# Altium project KeyboardMoudle.PrjPCB
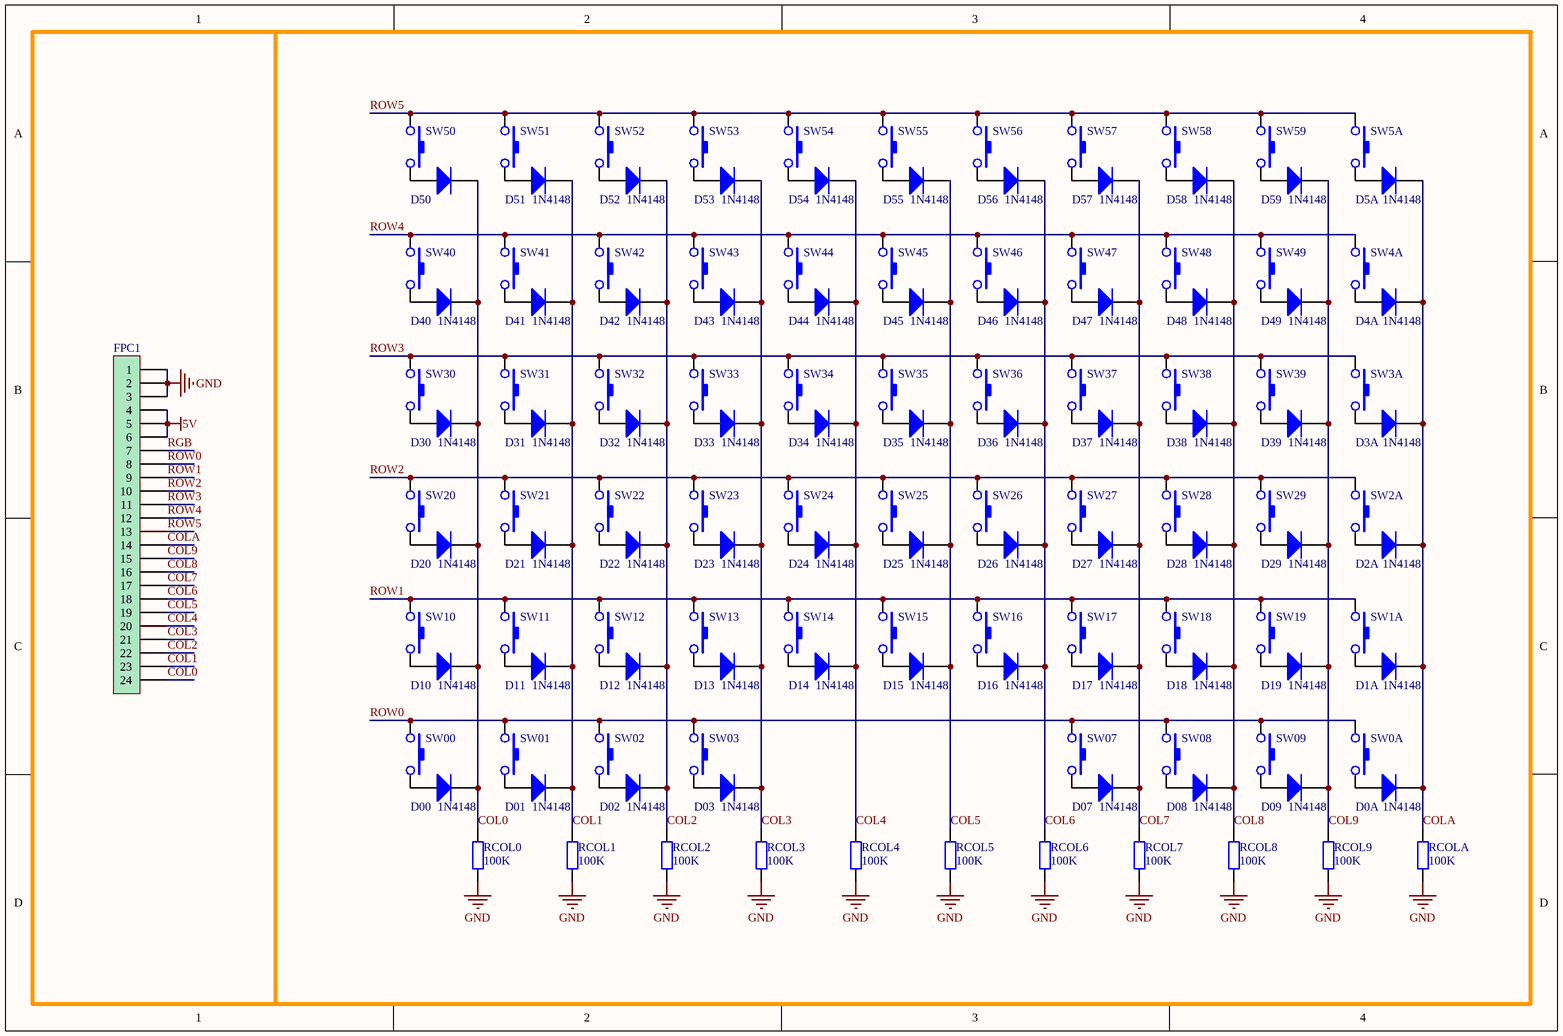
[diagram p0: KeyboardMoudle1.SchDoc]
2 sheets, 264 parts. Net scope: global (net labels, ports and power ports of the same name join across sheets).
Board file: KeyboardMoudle.PcbDoc
Sheets:
  KeyboardMoudle1.SchDoc
  KeyboardMoudle2.SchDoc

## Sheet KeyboardMoudle1.SchDoc
size A4

### Parts
D00  1N4148  [SOD523]
D0A  1N4148  [SOD523]
D01  1N4148  [SOD523]
D1A  1N4148  [SOD523]
D02  1N4148  [SOD523]
D2A  1N4148  [SOD523]
D03  1N4148  [SOD523]
D3A  1N4148  [SOD523]
D4A  1N4148  [SOD523]
D5A  1N4148  [SOD523]
D07  1N4148  [SOD523]
D08  1N4148  [SOD523]
D09  1N4148  [SOD523]
D10  1N4148  [SOD523]
D11  1N4148  [SOD523]
D12  1N4148  [SOD523]
D13  1N4148  [SOD523]
D14  1N4148  [SOD523]
D15  1N4148  [SOD523]
D16  1N4148  [SOD523]
D17  1N4148  [SOD523]
D18  1N4148  [SOD523]
D19  1N4148  [SOD523]
D20  1N4148  [SOD523]
D21  1N4148  [SOD523]
D22  1N4148  [SOD523]
D23  1N4148  [SOD523]
D24  1N4148  [SOD523]
D25  1N4148  [SOD523]
D26  1N4148  [SOD523]
D27  1N4148  [SOD523]
D28  1N4148  [SOD523]
D29  1N4148  [SOD523]
D30  1N4148  [SOD523]
D31  1N4148  [SOD523]
D32  1N4148  [SOD523]
D33  1N4148  [SOD523]
D34  1N4148  [SOD523]
D35  1N4148  [SOD523]
D36  1N4148  [SOD523]
D37  1N4148  [SOD523]
D38  1N4148  [SOD523]
D39  1N4148  [SOD523]
D40  1N4148  [SOD523]
D41  1N4148  [SOD523]
D42  1N4148  [SOD523]
D43  1N4148  [SOD523]
D44  1N4148  [SOD523]
D45  1N4148  [SOD523]
D46  1N4148  [SOD523]
D47  1N4148  [SOD523]
D48  1N4148  [SOD523]
D49  1N4148  [SOD523]
D50  (no value)  [SOD523]
D51  1N4148  [SOD523]
D52  1N4148  [SOD523]
D53  1N4148  [SOD523]
D54  1N4148  [SOD523]
D55  1N4148  [SOD523]
D56  1N4148  [SOD523]
D57  1N4148  [SOD523]
D58  1N4148  [SOD523]
D59  1N4148  [SOD523]
FPC1  FPC_0.5_24P  [FPC_0.5_24PIN]  (value not drawn)
RCOL0  100K  [R_0603]
RCOL1  100K  [R_0603]
RCOL2  100K  [R_0603]
RCOL3  100K  [R_0603]
RCOL4  100K  [R_0603]
RCOL5  100K  [R_0603]
RCOL6  100K  [R_0603]
RCOL7  100K  [R_0603]
RCOL8  100K  [R_0603]
RCOL9  100K  [R_0603]
RCOLA  100K  [R_0603]
SW00  KAILH  [KAILH_1350_HOTSWAP]  (value not drawn)
SW0A  KAILH  [KAILH_1350_HOTSWAP]  (value not drawn)
SW01  KAILH  [KAILH_1350_HOTSWAP]  (value not drawn)
SW1A  KAILH  [KAILH_1350_HOTSWAP]  (value not drawn)
SW02  KAILH  [KAILH_1350_HOTSWAP]  (value not drawn)
SW2A  KAILH  [KAILH_1350_HOTSWAP]  (value not drawn)
SW03  KAILH  [KAILH_1350_HOTSWAP]  (value not drawn)
SW3A  KAILH  [KAILH_1350_HOTSWAP]  (value not drawn)
SW4A  KAILH  [KAILH_1350_HOTSWAP]  (value not drawn)
SW5A  KAILH  [KAILH_1350_HOTSWAP]  (value not drawn)
SW07  KAILH  [KAILH_1350_HOTSWAP]  (value not drawn)
SW08  KAILH  [KAILH_1350_HOTSWAP]  (value not drawn)
SW09  KAILH  [KAILH_1350_HOTSWAP]  (value not drawn)
SW10  KAILH  [KAILH_1350_HOTSWAP]  (value not drawn)
SW11  KAILH  [KAILH_1350_HOTSWAP]  (value not drawn)
SW12  KAILH  [KAILH_1350_HOTSWAP]  (value not drawn)
SW13  KAILH  [KAILH_1350_HOTSWAP]  (value not drawn)
SW14  KAILH  [KAILH_1350_HOTSWAP]  (value not drawn)
SW15  KAILH  [KAILH_1350_HOTSWAP]  (value not drawn)
SW16  KAILH  [KAILH_1350_HOTSWAP]  (value not drawn)
SW17  KAILH  [KAILH_1350_HOTSWAP]  (value not drawn)
SW18  KAILH  [KAILH_1350_HOTSWAP]  (value not drawn)
SW19  KAILH  [KAILH_1350_HOTSWAP]  (value not drawn)
SW20  KAILH  [KAILH_1350_HOTSWAP]  (value not drawn)
SW21  KAILH  [KAILH_1350_HOTSWAP]  (value not drawn)
SW22  KAILH  [KAILH_1350_HOTSWAP]  (value not drawn)
SW23  KAILH  [KAILH_1350_HOTSWAP]  (value not drawn)
SW24  KAILH  [KAILH_1350_HOTSWAP]  (value not drawn)
SW25  KAILH  [KAILH_1350_HOTSWAP]  (value not drawn)
SW26  KAILH  [KAILH_1350_HOTSWAP]  (value not drawn)
SW27  KAILH  [KAILH_1350_HOTSWAP]  (value not drawn)
SW28  KAILH  [KAILH_1350_HOTSWAP]  (value not drawn)
SW29  KAILH  [KAILH_1350_HOTSWAP]  (value not drawn)
SW30  KAILH  [KAILH_1350_HOTSWAP]  (value not drawn)
SW31  KAILH  [KAILH_1350_HOTSWAP]  (value not drawn)
SW32  KAILH  [KAILH_1350_HOTSWAP]  (value not drawn)
SW33  KAILH  [KAILH_1350_HOTSWAP]  (value not drawn)
SW34  KAILH  [KAILH_1350_HOTSWAP]  (value not drawn)
SW35  KAILH  [KAILH_1350_HOTSWAP]  (value not drawn)
SW36  KAILH  [KAILH_1350_HOTSWAP]  (value not drawn)
SW37  KAILH  [KAILH_1350_HOTSWAP]  (value not drawn)
SW38  KAILH  [KAILH_1350_HOTSWAP]  (value not drawn)
SW39  KAILH  [KAILH_1350_HOTSWAP]  (value not drawn)
SW40  KAILH  [KAILH_1350_HOTSWAP]  (value not drawn)
SW41  KAILH  [KAILH_1350_HOTSWAP]  (value not drawn)
SW42  KAILH  [KAILH_1350_HOTSWAP]  (value not drawn)
SW43  KAILH  [KAILH_1350_HOTSWAP]  (value not drawn)
SW44  KAILH  [KAILH_1350_HOTSWAP]  (value not drawn)
SW45  KAILH  [KAILH_1350_HOTSWAP]  (value not drawn)
SW46  KAILH  [KAILH_1350_HOTSWAP]  (value not drawn)
SW47  KAILH  [KAILH_1350_HOTSWAP]  (value not drawn)
SW48  KAILH  [KAILH_1350_HOTSWAP]  (value not drawn)
SW49  KAILH  [KAILH_1350_HOTSWAP]  (value not drawn)
SW50  KAILH  [KAILH_1350_HOTSWAP]  (value not drawn)
SW51  KAILH  [KAILH_1350_HOTSWAP]  (value not drawn)
SW52  KAILH  [KAILH_1350_HOTSWAP]  (value not drawn)
SW53  KAILH  [KAILH_1350_HOTSWAP]  (value not drawn)
SW54  KAILH  [KAILH_1350_HOTSWAP]  (value not drawn)
SW55  KAILH  [KAILH_1350_HOTSWAP]  (value not drawn)
SW56  KAILH  [KAILH_1350_HOTSWAP]  (value not drawn)
SW57  KAILH  [KAILH_1350_HOTSWAP]  (value not drawn)
SW58  KAILH  [KAILH_1350_HOTSWAP]  (value not drawn)
SW59  KAILH  [KAILH_1350_HOTSWAP]  (value not drawn)

### Nets
5V: FPC1.4 FPC1.5 FPC1.6
GND: FPC1.1 FPC1.2 FPC1.3 RCOL0.1 RCOL1.1 RCOL2.1 RCOL3.1 RCOL4.1 RCOL5.1 RCOL6.1 RCOL7.1 RCOL8.1 RCOL9.1 RCOLA.1
COL0: D00.2(K) D10.2(K) D20.2(K) D30.2(K) D40.2(K) D50.2(K) FPC1.24 RCOL0.2
COL1: D01.2(K) D11.2(K) D21.2(K) D31.2(K) D41.2(K) D51.2(K) FPC1.23 RCOL1.2
COL2: D02.2(K) D12.2(K) D22.2(K) D32.2(K) D42.2(K) D52.2(K) FPC1.22 RCOL2.2
COL3: D03.2(K) D13.2(K) D23.2(K) D33.2(K) D43.2(K) D53.2(K) FPC1.21 RCOL3.2
COL4: D14.2(K) D24.2(K) D34.2(K) D44.2(K) D54.2(K) FPC1.20 RCOL4.2
COL5: D15.2(K) D25.2(K) D35.2(K) D45.2(K) D55.2(K) FPC1.19 RCOL5.2
COL6: D16.2(K) D26.2(K) D36.2(K) D46.2(K) D56.2(K) FPC1.18 RCOL6.2
COL7: D07.2(K) D17.2(K) D27.2(K) D37.2(K) D47.2(K) D57.2(K) FPC1.17 RCOL7.2
COL8: D08.2(K) D18.2(K) D28.2(K) D38.2(K) D48.2(K) D58.2(K) FPC1.16 RCOL8.2
COL9: D09.2(K) D19.2(K) D29.2(K) D39.2(K) D49.2(K) D59.2(K) FPC1.15 RCOL9.2
COLA: D0A.2(K) D1A.2(K) D2A.2(K) D3A.2(K) D4A.2(K) D5A.2(K) FPC1.14 RCOLA.2
RGB: FPC1.7
ROW0: FPC1.8 SW00.1 SW0A.1 SW01.1 SW02.1 SW03.1 SW07.1 SW08.1 SW09.1
ROW1: FPC1.9 SW1A.1 SW10.1 SW11.1 SW12.1 SW13.1 SW14.1 SW15.1 SW16.1 SW17.1 SW18.1 SW19.1
ROW2: FPC1.10 SW2A.1 SW20.1 SW21.1 SW22.1 SW23.1 SW24.1 SW25.1 SW26.1 SW27.1 SW28.1 SW29.1
ROW3: FPC1.11 SW3A.1 SW30.1 SW31.1 SW32.1 SW33.1 SW34.1 SW35.1 SW36.1 SW37.1 SW38.1 SW39.1
ROW4: FPC1.12 SW4A.1 SW40.1 SW41.1 SW42.1 SW43.1 SW44.1 SW45.1 SW46.1 SW47.1 SW48.1 SW49.1
ROW5: FPC1.13 SW5A.1 SW50.1 SW51.1 SW52.1 SW53.1 SW54.1 SW55.1 SW56.1 SW57.1 SW58.1 SW59.1
NetD00_1: D00.1(A) SW00.2
NetD0A_1: D0A.1(A) SW0A.2
NetD01_1: D01.1(A) SW01.2
NetD1A_1: D1A.1(A) SW1A.2
NetD02_1: D02.1(A) SW02.2
NetD2A_1: D2A.1(A) SW2A.2
NetD03_1: D03.1(A) SW03.2
NetD3A_1: D3A.1(A) SW3A.2
NetD4A_1: D4A.1(A) SW4A.2
NetD5A_1: D5A.1(A) SW5A.2
NetD07_1: D07.1(A) SW07.2
NetD08_1: D08.1(A) SW08.2
NetD09_1: D09.1(A) SW09.2
NetD10_1: D10.1(A) SW10.2
NetD11_1: D11.1(A) SW11.2
NetD12_1: D12.1(A) SW12.2
NetD13_1: D13.1(A) SW13.2
NetD14_1: D14.1(A) SW14.2
NetD15_1: D15.1(A) SW15.2
NetD16_1: D16.1(A) SW16.2
NetD17_1: D17.1(A) SW17.2
NetD18_1: D18.1(A) SW18.2
NetD19_1: D19.1(A) SW19.2
NetD20_1: D20.1(A) SW20.2
NetD21_1: D21.1(A) SW21.2
NetD22_1: D22.1(A) SW22.2
NetD23_1: D23.1(A) SW23.2
NetD24_1: D24.1(A) SW24.2
NetD25_1: D25.1(A) SW25.2
NetD26_1: D26.1(A) SW26.2
NetD27_1: D27.1(A) SW27.2
NetD28_1: D28.1(A) SW28.2
NetD29_1: D29.1(A) SW29.2
NetD30_1: D30.1(A) SW30.2
NetD31_1: D31.1(A) SW31.2
NetD32_1: D32.1(A) SW32.2
NetD33_1: D33.1(A) SW33.2
NetD34_1: D34.1(A) SW34.2
NetD35_1: D35.1(A) SW35.2
NetD36_1: D36.1(A) SW36.2
NetD37_1: D37.1(A) SW37.2
NetD38_1: D38.1(A) SW38.2
NetD39_1: D39.1(A) SW39.2
NetD40_1: D40.1(A) SW40.2
NetD41_1: D41.1(A) SW41.2
NetD42_1: D42.1(A) SW42.2
NetD43_1: D43.1(A) SW43.2
NetD44_1: D44.1(A) SW44.2
NetD45_1: D45.1(A) SW45.2
NetD46_1: D46.1(A) SW46.2
NetD47_1: D47.1(A) SW47.2
NetD48_1: D48.1(A) SW48.2
NetD49_1: D49.1(A) SW49.2
NetD50_1: D50.1(A) SW50.2
NetD51_1: D51.1(A) SW51.2
NetD52_1: D52.1(A) SW52.2
NetD53_1: D53.1(A) SW53.2
NetD54_1: D54.1(A) SW54.2
NetD55_1: D55.1(A) SW55.2
NetD56_1: D56.1(A) SW56.2
NetD57_1: D57.1(A) SW57.2
NetD58_1: D58.1(A) SW58.2
NetD59_1: D59.1(A) SW59.2

### Library data of the parts
D00 D0A D01 D1A D02 D2A D03 D3A D4A D5A D07 D08 D09-D59 = DIO_1N4148_SOD523: 开关二极管
FPC1 = FPC_0.5_24P: FPC 0.5 24Pin
RCOL0-RCOL9 RCOLA = RES_0603: 电阻 0603
SW00 SW0A SW01 SW1A SW02 SW2A SW03 SW3A SW4A SW5A SW07 SW08 SW09-SW59 = SWITCH_KAILH_1350: 凯华机械矮轴1350用热插拔轴座

## Sheet KeyboardMoudle2.SchDoc
size A4
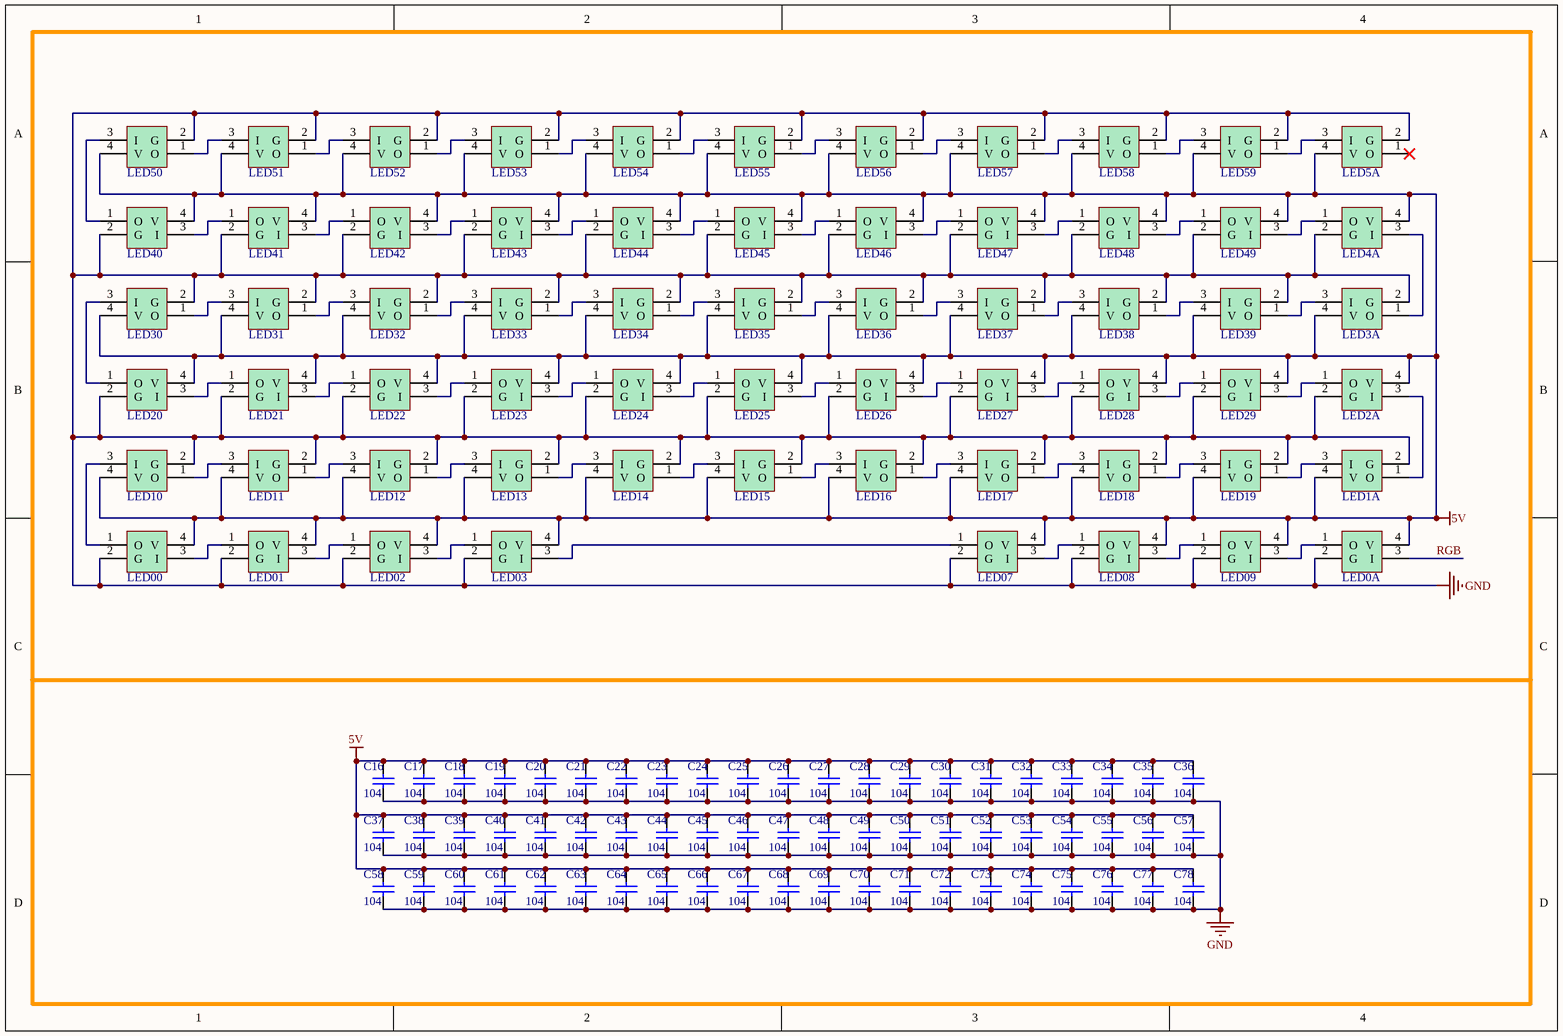
[diagram p1: KeyboardMoudle2.SchDoc]

### Parts
C16  104  [0603]
C17  104  [0603]
C18  104  [0603]
C19  104  [0603]
C20  104  [0603]
C21  104  [0603]
C22  104  [0603]
C23  104  [0603]
C24  104  [0603]
C25  104  [0603]
C26  104  [0603]
C27  104  [0603]
C28  104  [0603]
C29  104  [0603]
C30  104  [0603]
C31  104  [0603]
C32  104  [0603]
C33  104  [0603]
C34  104  [0603]
C35  104  [0603]
C36  104  [0603]
C37  104  [0603]
C38  104  [0603]
C39  104  [0603]
C40  104  [0603]
C41  104  [0603]
C42  104  [0603]
C43  104  [0603]
C44  104  [0603]
C45  104  [0603]
C46  104  [0603]
C47  104  [0603]
C48  104  [0603]
C49  104  [0603]
C50  104  [0603]
C51  104  [0603]
C52  104  [0603]
C53  104  [0603]
C54  104  [0603]
C55  104  [0603]
C56  104  [0603]
C57  104  [0603]
C58  104  [0603]
C59  104  [0603]
C60  104  [0603]
C61  104  [0603]
C62  104  [0603]
C63  104  [0603]
C64  104  [0603]
C65  104  [0603]
C66  104  [0603]
C67  104  [0603]
C68  104  [0603]
C69  104  [0603]
C70  104  [0603]
C71  104  [0603]
C72  104  [0603]
C73  104  [0603]
C74  104  [0603]
C75  104  [0603]
C76  104  [0603]
C77  104  [0603]
C78  104  [0603]
LED00  WS2812  [LED_WS2812_2020]  (value not drawn)
LED0A  WS2812  [LED_WS2812_2020]  (value not drawn)
LED01  WS2812  [LED_WS2812_2020]  (value not drawn)
LED1A  WS2812  [LED_WS2812_2020]  (value not drawn)
LED02  WS2812  [LED_WS2812_2020]  (value not drawn)
LED2A  WS2812  [LED_WS2812_2020]  (value not drawn)
LED03  WS2812  [LED_WS2812_2020]  (value not drawn)
LED3A  WS2812  [LED_WS2812_2020]  (value not drawn)
LED4A  WS2812  [LED_WS2812_2020]  (value not drawn)
LED5A  WS2812  [LED_WS2812_2020]  (value not drawn)
LED07  WS2812  [LED_WS2812_2020]  (value not drawn)
LED08  WS2812  [LED_WS2812_2020]  (value not drawn)
LED09  WS2812  [LED_WS2812_2020]  (value not drawn)
LED10  WS2812  [LED_WS2812_2020]  (value not drawn)
LED11  WS2812  [LED_WS2812_2020]  (value not drawn)
LED12  WS2812  [LED_WS2812_2020]  (value not drawn)
LED13  WS2812  [LED_WS2812_2020]  (value not drawn)
LED14  WS2812  [LED_WS2812_2020]  (value not drawn)
LED15  WS2812  [LED_WS2812_2020]  (value not drawn)
LED16  WS2812  [LED_WS2812_2020]  (value not drawn)
LED17  WS2812  [LED_WS2812_2020]  (value not drawn)
LED18  WS2812  [LED_WS2812_2020]  (value not drawn)
LED19  WS2812  [LED_WS2812_2020]  (value not drawn)
LED20  WS2812  [LED_WS2812_2020]  (value not drawn)
LED21  WS2812  [LED_WS2812_2020]  (value not drawn)
LED22  WS2812  [LED_WS2812_2020]  (value not drawn)
LED23  WS2812  [LED_WS2812_2020]  (value not drawn)
LED24  WS2812  [LED_WS2812_2020]  (value not drawn)
LED25  WS2812  [LED_WS2812_2020]  (value not drawn)
LED26  WS2812  [LED_WS2812_2020]  (value not drawn)
LED27  WS2812  [LED_WS2812_2020]  (value not drawn)
LED28  WS2812  [LED_WS2812_2020]  (value not drawn)
LED29  WS2812  [LED_WS2812_2020]  (value not drawn)
LED30  WS2812  [LED_WS2812_2020]  (value not drawn)
LED31  WS2812  [LED_WS2812_2020]  (value not drawn)
LED32  WS2812  [LED_WS2812_2020]  (value not drawn)
LED33  WS2812  [LED_WS2812_2020]  (value not drawn)
LED34  WS2812  [LED_WS2812_2020]  (value not drawn)
LED35  WS2812  [LED_WS2812_2020]  (value not drawn)
LED36  WS2812  [LED_WS2812_2020]  (value not drawn)
LED37  WS2812  [LED_WS2812_2020]  (value not drawn)
LED38  WS2812  [LED_WS2812_2020]  (value not drawn)
LED39  WS2812  [LED_WS2812_2020]  (value not drawn)
LED40  WS2812  [LED_WS2812_2020]  (value not drawn)
LED41  WS2812  [LED_WS2812_2020]  (value not drawn)
LED42  WS2812  [LED_WS2812_2020]  (value not drawn)
LED43  WS2812  [LED_WS2812_2020]  (value not drawn)
LED44  WS2812  [LED_WS2812_2020]  (value not drawn)
LED45  WS2812  [LED_WS2812_2020]  (value not drawn)
LED46  WS2812  [LED_WS2812_2020]  (value not drawn)
LED47  WS2812  [LED_WS2812_2020]  (value not drawn)
LED48  WS2812  [LED_WS2812_2020]  (value not drawn)
LED49  WS2812  [LED_WS2812_2020]  (value not drawn)
LED50  WS2812  [LED_WS2812_2020]  (value not drawn)
LED51  WS2812  [LED_WS2812_2020]  (value not drawn)
LED52  WS2812  [LED_WS2812_2020]  (value not drawn)
LED53  WS2812  [LED_WS2812_2020]  (value not drawn)
LED54  WS2812  [LED_WS2812_2020]  (value not drawn)
LED55  WS2812  [LED_WS2812_2020]  (value not drawn)
LED56  WS2812  [LED_WS2812_2020]  (value not drawn)
LED57  WS2812  [LED_WS2812_2020]  (value not drawn)
LED58  WS2812  [LED_WS2812_2020]  (value not drawn)
LED59  WS2812  [LED_WS2812_2020]  (value not drawn)

### Nets
5V: C16.2 C17.2 C18.2 C19.2 C20.2 C21.2 C22.2 C23.2 C24.2 C25.2 C26.2 C27.2 C28.2 C29.2 C30.2 C31.2 C32.2 C33.2 C34.2 C35.2 C36.2 C37.2 C38.2 C39.2 C40.2 C41.2 C42.2 C43.2 C44.2 C45.2 C46.2 C47.2 C48.2 C49.2 C50.2 C51.2 C52.2 C53.2 C54.2 C55.2 C56.2 C57.2 C58.2 C59.2 C60.2 C61.2 C62.2 C63.2 C64.2 C65.2 C66.2 C67.2 C68.2 C69.2 C70.2 C71.2 C72.2 C73.2 C74.2 C75.2 C76.2 C77.2 C78.2 LED00.4(V) LED0A.4(V) LED01.4(V) LED1A.4(V) LED02.4(V) LED2A.4(V) LED03.4(V) LED3A.4(V) LED4A.4(V) LED5A.4(V) LED07.4(V) LED08.4(V) LED09.4(V) LED10.4(V) LED11.4(V) LED12.4(V) LED13.4(V) LED14.4(V) LED15.4(V) LED16.4(V) LED17.4(V) LED18.4(V) LED19.4(V) LED20.4(V) LED21.4(V) LED22.4(V) LED23.4(V) LED24.4(V) LED25.4(V) LED26.4(V) LED27.4(V) LED28.4(V) LED29.4(V) LED30.4(V) LED31.4(V) LED32.4(V) LED33.4(V) LED34.4(V) LED35.4(V) LED36.4(V) LED37.4(V) LED38.4(V) LED39.4(V) LED40.4(V) LED41.4(V) LED42.4(V) LED43.4(V) LED44.4(V) LED45.4(V) LED46.4(V) LED47.4(V) LED48.4(V) LED49.4(V) LED50.4(V) LED51.4(V) LED52.4(V) LED53.4(V) LED54.4(V) LED55.4(V) LED56.4(V) LED57.4(V) LED58.4(V) LED59.4(V)
GND: C16.1 C17.1 C18.1 C19.1 C20.1 C21.1 C22.1 C23.1 C24.1 C25.1 C26.1 C27.1 C28.1 C29.1 C30.1 C31.1 C32.1 C33.1 C34.1 C35.1 C36.1 C37.1 C38.1 C39.1 C40.1 C41.1 C42.1 C43.1 C44.1 C45.1 C46.1 C47.1 C48.1 C49.1 C50.1 C51.1 C52.1 C53.1 C54.1 C55.1 C56.1 C57.1 C58.1 C59.1 C60.1 C61.1 C62.1 C63.1 C64.1 C65.1 C66.1 C67.1 C68.1 C69.1 C70.1 C71.1 C72.1 C73.1 C74.1 C75.1 C76.1 C77.1 C78.1 LED00.2(G) LED0A.2(G) LED01.2(G) LED1A.2(G) LED02.2(G) LED2A.2(G) LED03.2(G) LED3A.2(G) LED4A.2(G) LED5A.2(G) LED07.2(G) LED08.2(G) LED09.2(G) LED10.2(G) LED11.2(G) LED12.2(G) LED13.2(G) LED14.2(G) LED15.2(G) LED16.2(G) LED17.2(G) LED18.2(G) LED19.2(G) LED20.2(G) LED21.2(G) LED22.2(G) LED23.2(G) LED24.2(G) LED25.2(G) LED26.2(G) LED27.2(G) LED28.2(G) LED29.2(G) LED30.2(G) LED31.2(G) LED32.2(G) LED33.2(G) LED34.2(G) LED35.2(G) LED36.2(G) LED37.2(G) LED38.2(G) LED39.2(G) LED40.2(G) LED41.2(G) LED42.2(G) LED43.2(G) LED44.2(G) LED45.2(G) LED46.2(G) LED47.2(G) LED48.2(G) LED49.2(G) LED50.2(G) LED51.2(G) LED52.2(G) LED53.2(G) LED54.2(G) LED55.2(G) LED56.2(G) LED57.2(G) LED58.2(G) LED59.2(G)
RGB: LED0A.3(I)
NetLED00_1: LED00.1(O) LED10.3(I)
NetLED00_3: LED00.3(I) LED01.1(O)
NetLED0A_1: LED0A.1(O) LED09.3(I)
NetLED01_3: LED01.3(I) LED02.1(O)
NetLED1A_1: LED1A.1(O) LED2A.3(I)
NetLED1A_3: LED1A.3(I) LED19.1(O)
NetLED02_3: LED02.3(I) LED03.1(O)
NetLED2A_1: LED2A.1(O) LED29.3(I)
NetLED03_3: LED03.3(I) LED07.1(O)
NetLED3A_1: LED3A.1(O) LED4A.3(I)
NetLED3A_3: LED3A.3(I) LED39.1(O)
NetLED4A_1: LED4A.1(O) LED49.3(I)
NetLED5A_3: LED5A.3(I) LED59.1(O)
NetLED07_3: LED07.3(I) LED08.1(O)
NetLED08_3: LED08.3(I) LED09.1(O)
NetLED10_1: LED10.1(O) LED11.3(I)
NetLED11_1: LED11.1(O) LED12.3(I)
NetLED12_1: LED12.1(O) LED13.3(I)
NetLED13_1: LED13.1(O) LED14.3(I)
NetLED14_1: LED14.1(O) LED15.3(I)
NetLED15_1: LED15.1(O) LED16.3(I)
NetLED16_1: LED16.1(O) LED17.3(I)
NetLED17_1: LED17.1(O) LED18.3(I)
NetLED18_1: LED18.1(O) LED19.3(I)
NetLED20_1: LED20.1(O) LED30.3(I)
NetLED20_3: LED20.3(I) LED21.1(O)
NetLED21_3: LED21.3(I) LED22.1(O)
NetLED22_3: LED22.3(I) LED23.1(O)
NetLED23_3: LED23.3(I) LED24.1(O)
NetLED24_3: LED24.3(I) LED25.1(O)
NetLED25_3: LED25.3(I) LED26.1(O)
NetLED26_3: LED26.3(I) LED27.1(O)
NetLED27_3: LED27.3(I) LED28.1(O)
NetLED28_3: LED28.3(I) LED29.1(O)
NetLED30_1: LED30.1(O) LED31.3(I)
NetLED31_1: LED31.1(O) LED32.3(I)
NetLED32_1: LED32.1(O) LED33.3(I)
NetLED33_1: LED33.1(O) LED34.3(I)
NetLED34_1: LED34.1(O) LED35.3(I)
NetLED35_1: LED35.1(O) LED36.3(I)
NetLED36_1: LED36.1(O) LED37.3(I)
NetLED37_1: LED37.1(O) LED38.3(I)
NetLED38_1: LED38.1(O) LED39.3(I)
NetLED40_1: LED40.1(O) LED50.3(I)
NetLED40_3: LED40.3(I) LED41.1(O)
NetLED41_3: LED41.3(I) LED42.1(O)
NetLED42_3: LED42.3(I) LED43.1(O)
NetLED43_3: LED43.3(I) LED44.1(O)
NetLED44_3: LED44.3(I) LED45.1(O)
NetLED45_3: LED45.3(I) LED46.1(O)
NetLED46_3: LED46.3(I) LED47.1(O)
NetLED47_3: LED47.3(I) LED48.1(O)
NetLED48_3: LED48.3(I) LED49.1(O)
NetLED50_1: LED50.1(O) LED51.3(I)
NetLED51_1: LED51.1(O) LED52.3(I)
NetLED52_1: LED52.1(O) LED53.3(I)
NetLED53_1: LED53.1(O) LED54.3(I)
NetLED54_1: LED54.1(O) LED55.3(I)
NetLED55_1: LED55.1(O) LED56.3(I)
NetLED56_1: LED56.1(O) LED57.3(I)
NetLED57_1: LED57.1(O) LED58.3(I)
NetLED58_1: LED58.1(O) LED59.3(I)

Not connected (* = marked no-connect by the designer): LED5A 1(O)*

### Library data of the parts
C16-C78 = CAP_0603: 贴片电容 0603
LED00 LED0A LED01 LED1A LED02 LED2A LED03 LED3A LED4A LED5A LED07 LED08 LED09-LED59 = LED_WS2812_2020: WS2812 LED

## Nets that join several sheets
5V: KeyboardMoudle1 (FPC1.4 FPC1.5 FPC1.6), KeyboardMoudle2 (126 pins)
GND: KeyboardMoudle1 (14 pins), KeyboardMoudle2 (126 pins)
RGB: KeyboardMoudle1 (FPC1.7), KeyboardMoudle2 (LED0A.3)